# EAGLE design AVR-Pocket-Programmer (EAGLE 9.3.0)
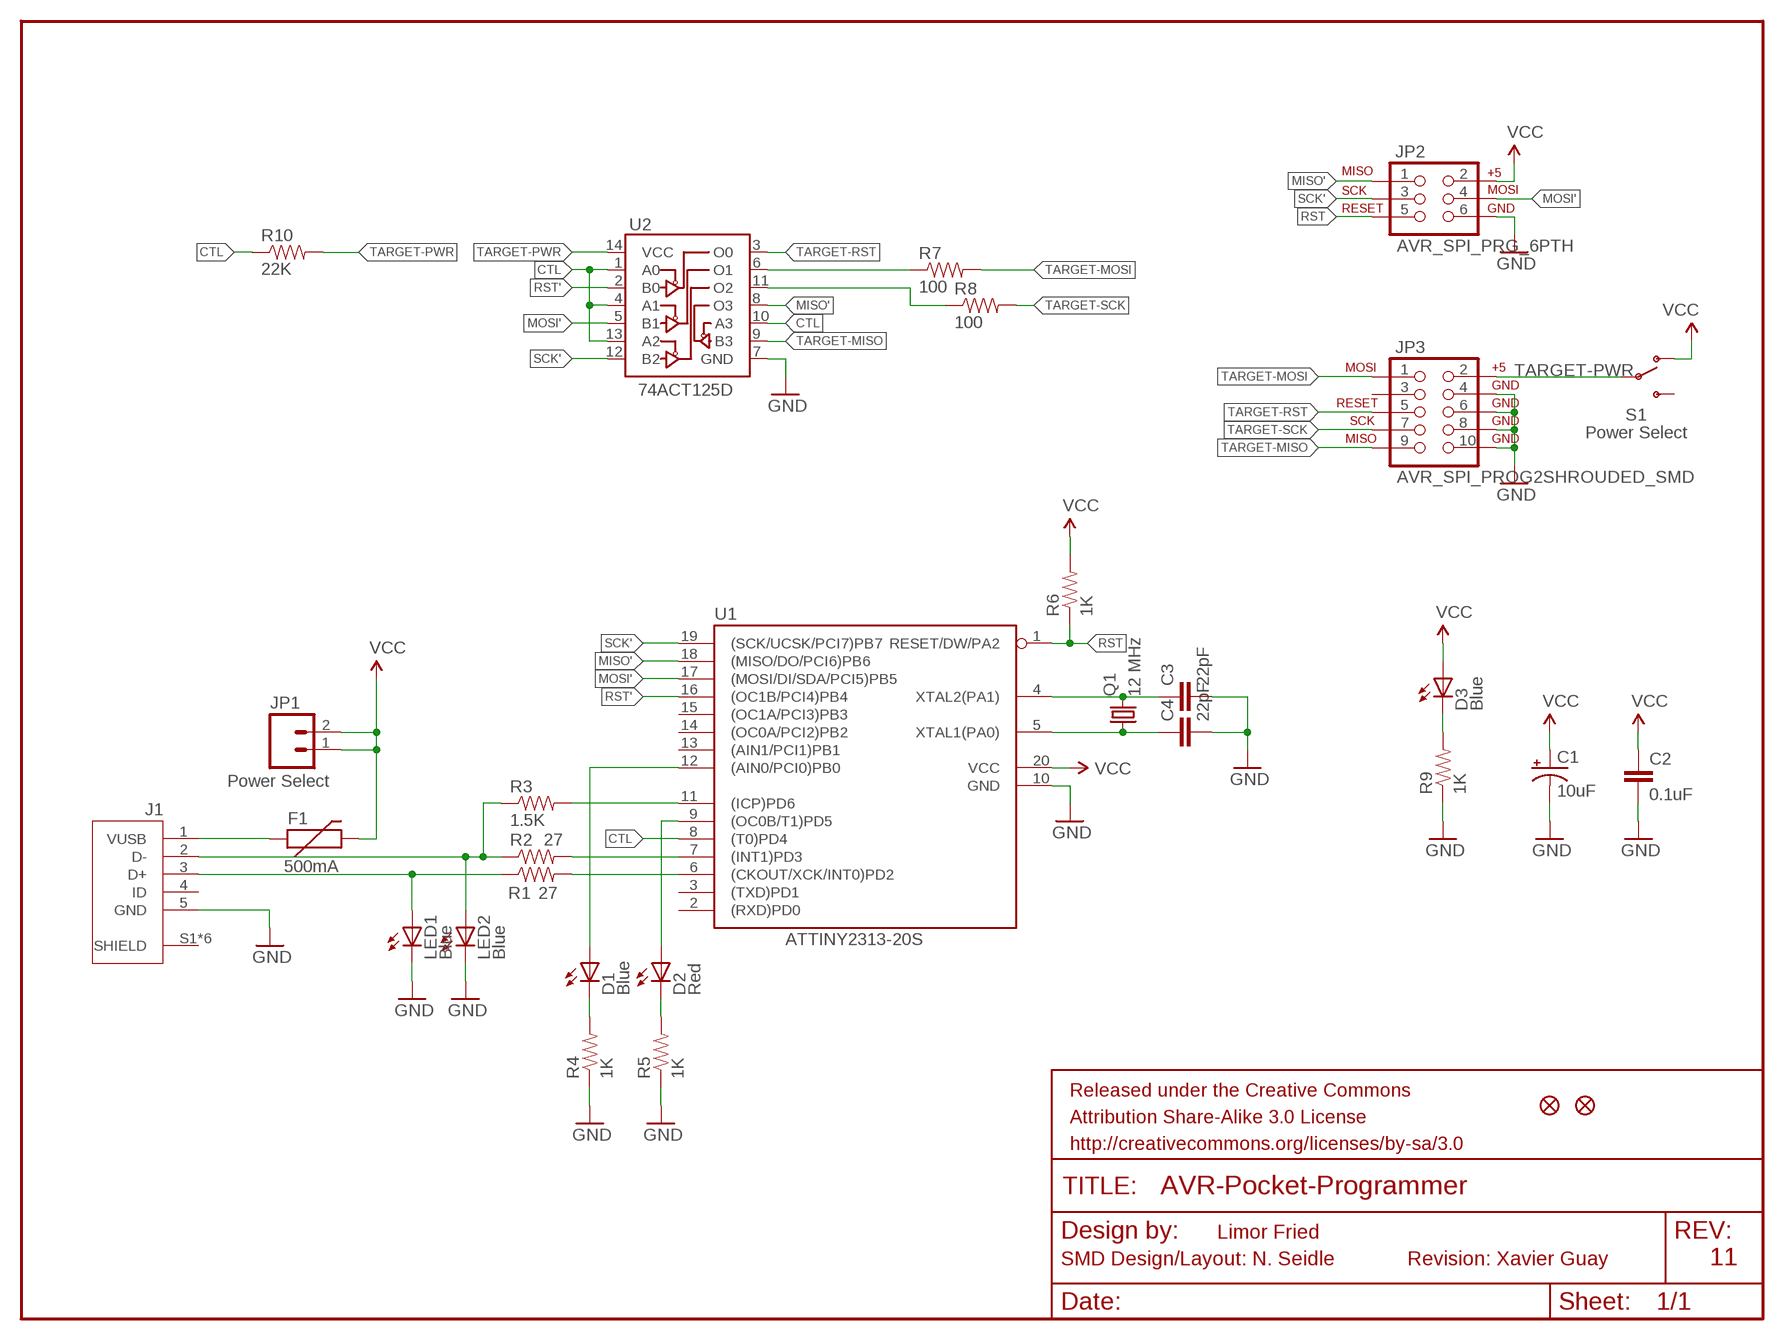
[diagram p0: schematic, sheet 1]

## Parts
C1  10uF  CAP_POL1206  [EIA3216]
C2  0.1uF  CAP0603-CAP  [0603-CAP]
C3  22pF  CAP0603-CAP  [0603-CAP]
C4  22pF  CAP0603-CAP  [0603-CAP]
D1  Blue  LED0603  [LED-0603]
D2  Red  LED0603  [LED-0603]
D3  Blue  LED0603  [LED-0603]
F1  500mA  PTCSMD-W  [PTC-1206-WIDE]
FRAME1  FRAME-LETTER  [CREATIVE_COMMONS]
J1  10118193-0001LF  [FCI_10118193-0001LF]
JP1  Power Select  M02PTH  [1X02]
JP2  AVR_SPI_PRG_6PTH  [2X3]
JP3  AVR_SPI_PROG2SHROUDED_SMD  [2X5-SHROUDED_SMD]
LED1  Blue  LED0603  [LED-0603]
LED2  Blue  LED0603  [LED-0603]
Q1  12 MHz  CRYSTAL5X3  [CRYSTAL-SMD-5X3]
R1  27  RESISTOR0603-RES  [0603-RES]
R2  27  RESISTOR0603-RES  [0603-RES]
R3  1.5K  RESISTOR0603-RES  [0603-RES]
R4  1K  RESISTOR0603-RES  [0603-RES]
R5  1K  RESISTOR0603-RES  [0603-RES]
R6  1K  RESISTOR0603-RES  [0603-RES]
R7  100  RESISTOR0603-RES  [0603-RES]
R8  100  RESISTOR0603-RES  [0603-RES]
R9  1K  RESISTOR0603-RES  [0603-RES]
R10  22K  RESISTOR0603-RES  [0603-RES]
S1  Power Select  SWITCH-SPSTSMD  [AYZ0202]
U1  ATTINY2313-20S  [SO20L]
U2  74ACT125D  [SO014]
U$6  FIDUCIAL1X2  [FIDUCIAL-1X2]
U$7  FIDUCIAL1X2  [FIDUCIAL-1X2]

## Nets
CTL: R10.1 U1.8((T0)PD4) U2.1(A0) U2.4(A1) U2.10(A3) U2.13(A2)
D+: J1.3(D+) LED1.A R1.1
D-: J1.2(D-) LED2.A R2.1 R3.1
GND: C1.C(-) C2.2 C3.2 C4.2 J1.5(GND) JP2.6 JP3.4 JP3.6 JP3.8 JP3.10 LED1.C LED2.C R4.1 R5.1 R9.1 U1.10(GND) U2.7(GND)
MISO': JP2.1 U1.18((MISO/DO/PCI6)PB6) U2.8(O3)
MOSI': JP2.4 U1.17((MOSI/DI/SDA/PCI5)PB5) U2.5(B1)
N$1: R3.2 U1.11((ICP)PD6)
N$2: D2.A U1.9((OC0B/T1)PD5)
N$3: D3.C R9.2
N$4: F1.1 J1.1(VUSB)
N$5: C3.1 Q1.3 U1.4(XTAL2(PA1))
N$6: C4.1 Q1.1 U1.5(XTAL1(PA0))
N$17: D1.A U1.12((AIN0/PCI0)PB0)
N$18: D1.C R4.2
N$19: D2.C R5.2
N$22: R7.1 U2.6(O1)
N$25: R8.1 U2.11(O2)
PD+: R1.2 U1.6((CKOUT/XCK/INT0)PD2)
PD-: R2.2 U1.7((INT1)PD3)
RST: JP2.5 R6.1 U1.1(RESET/DW/PA2)
RST': U1.16((OC1B/PCI4)PB4) U2.2(B0)
SCK': JP2.3 U1.19((SCK/UCSK/PCI7)PB7) U2.12(B2)
TARGET-MISO: JP3.9 U2.9(B3)
TARGET-MOSI: JP3.1 R7.2
TARGET-PWR: JP3.2 R10.2 S1.2(P) U2.14(VCC)
TARGET-RST: JP3.5 U2.3(O0)
TARGET-SCK: JP3.7 R8.2
VCC: C1.A(+) C2.1 D3.A F1.2 JP1.1 JP1.2 JP2.2 R6.2 S1.1(O) U1.20(VCC)
Unconnected: J1.4(ID) J1.S1(SHIELD) J1.S2(SHIELD) J1.S3(SHIELD) J1.S4(SHIELD) J1.S5(SHIELD) J1.S6(SHIELD) JP3.3 S1.3(S) U1.2((RXD)PD0) U1.3((TXD)PD1) U1.13((AIN1/PCI1)PB1) U1.14((OC0A/PCI2)PB2) U1.15((OC1A/PCI3)PB3)

## Notes on the sheet
- Limor Fried
- SMD Design/Layout: N. Seidle | Revision: Xavier Guay | 11

## Library data of the parts
C1 = SparkFun:CAP_POL: Capacitor Polarized These are standard SMD and PTH capacitors. Normally 10uF, 47uF, and 100uF in electrolytic and tantalum varieties. Always verify the external diameter of the through hole cap, it varies with capacity, voltage, and manufacturer. The EIA devices should be standard.
C2-C4 = SparkFun:CAP: Capacitor Standard 0603 ceramic capacitor, and 0.1" leaded capacitor.
D1-D3 LED1 LED2 = SparkFun:LED: LEDs Standard schematic elements and footprints for 5mm, 3mm, 1206, and 0603 sized LEDs. 5mm - Spark Fun Electronics SKU : COM-00529 (and others)
F1 = SparkFun-PowerIC:PTC: Resettable Fuse PTC Resettable Fuse. Spark Fun Electronics SKU : COM-08357
FRAME1 = SparkFun-Aesthetics:FRAME-LETTER: Schematic Frame Standard 8.5x11 US Letter frame
J1 = USB-Micro:10118193-0001LF: Micro USB B Type Receptacle; DESCRIPTION: Conn Micro USB Type B RCP 5 POS 0.65mm Solder RA SMD 5 Terminal 1 Port T/R; DIGI-KEY_PART_NUMBER: 609-4616-1-ND; DIGI-KEY_PURCHASE_URL: https://www.digikey.com/product-detail/en/amphenol-icc-fci/10118193-0001LF/609-4616-1-ND/2785380?utm_source=snapeda&utm_medium=aggregator&utm_campaign=symbol; MF: Amphenol ICC; MP: 10118193-0001LF; PACKAGE: None
JP1 = SparkFun:M02: Header 2 Standard 2-pin 0.1" header. Use with straight break away headers (SKU : PRT-00116), right angle break away headers (PRT-00553), swiss pins (PRT-00743), machine pins (PRT-00117), and female headers (PRT-00115). Molex polarized connector foot print use with SKU : PRT-08233 with associated crimp pins and housings.
JP2 = SparkFun:AVR_SPI_PRG_6: AVR ISP 6 Pin This is the reduced ISP connector for AVR programming. Common on Arduino. This footprint will take up less PCB space and can be used with a 10-pin to 6-pin adapter such as SKU: BOB-08508
JP3 = SparkFun:AVR_SPI_PROG2: AVR ICSP Header This is the standard AVR In Circuit Serial Programming header. Minimal, but includes pin one indicator. Works with standard Olimex programmers. Also look for the 6-pin reduced version. Spark Fun Electronics SKU: PRT-00778. Note that the Variant "Shrouded_SMD" is an SMD part and will not work with the thru-hole connector.
Q1 = SparkFun:CRYSTAL: Crystals Various standard crystals. Proven footprints. Spark Fun Electronics SKU : COM-00534
R1-R10 = SparkFun:RESISTOR: Resistor Basic schematic elements and footprints for 0603, 1206, and PTH 1/10th watt (small) resistors.
S1 = SparkFun:SWITCH-SPST: SPST Switch Simple slide switch. Spark Fun Electronics SKU : COM-00102
U1 = avr:ATTINY2313: MICROCONTROLLER 2 Kbytes FLASH 128 bytes SRAM 128 bytes EEPROM USART USI
U2 = SparkFun:74ACT125D: Quad Buffer with 3-State Outputs- ON Semi Conductor: Digikey P/N MC74ACT125DR2GOSTR-ND
U$6 U$7 = SparkFun:FIDUCIAL: Fiducial Alignment Points Various fiducial points for machine vision alignment.

## Net classes
0 default: width 0.203 mm, drill 0.508 mm, clearance 0.203 mm

## Board
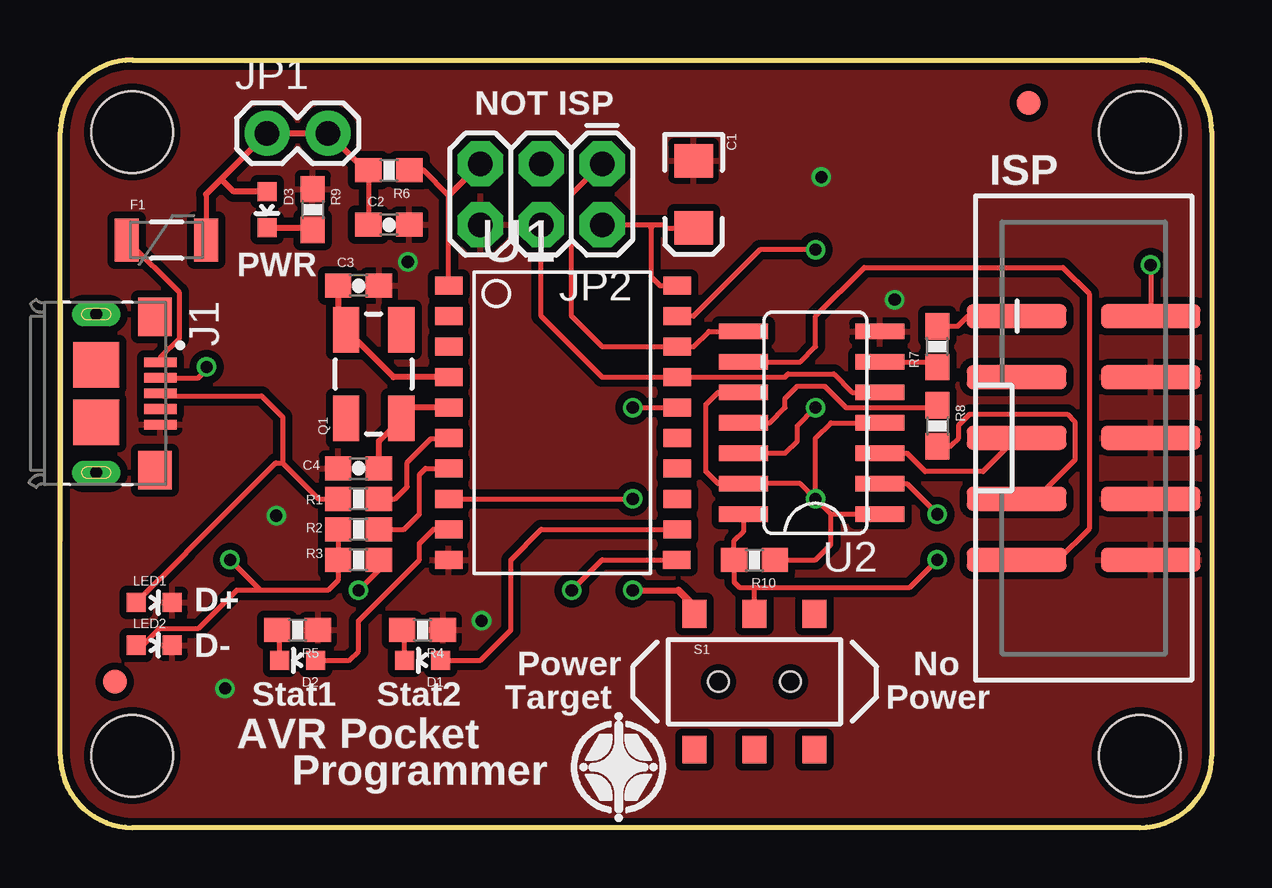
[diagram p1: board, top side]
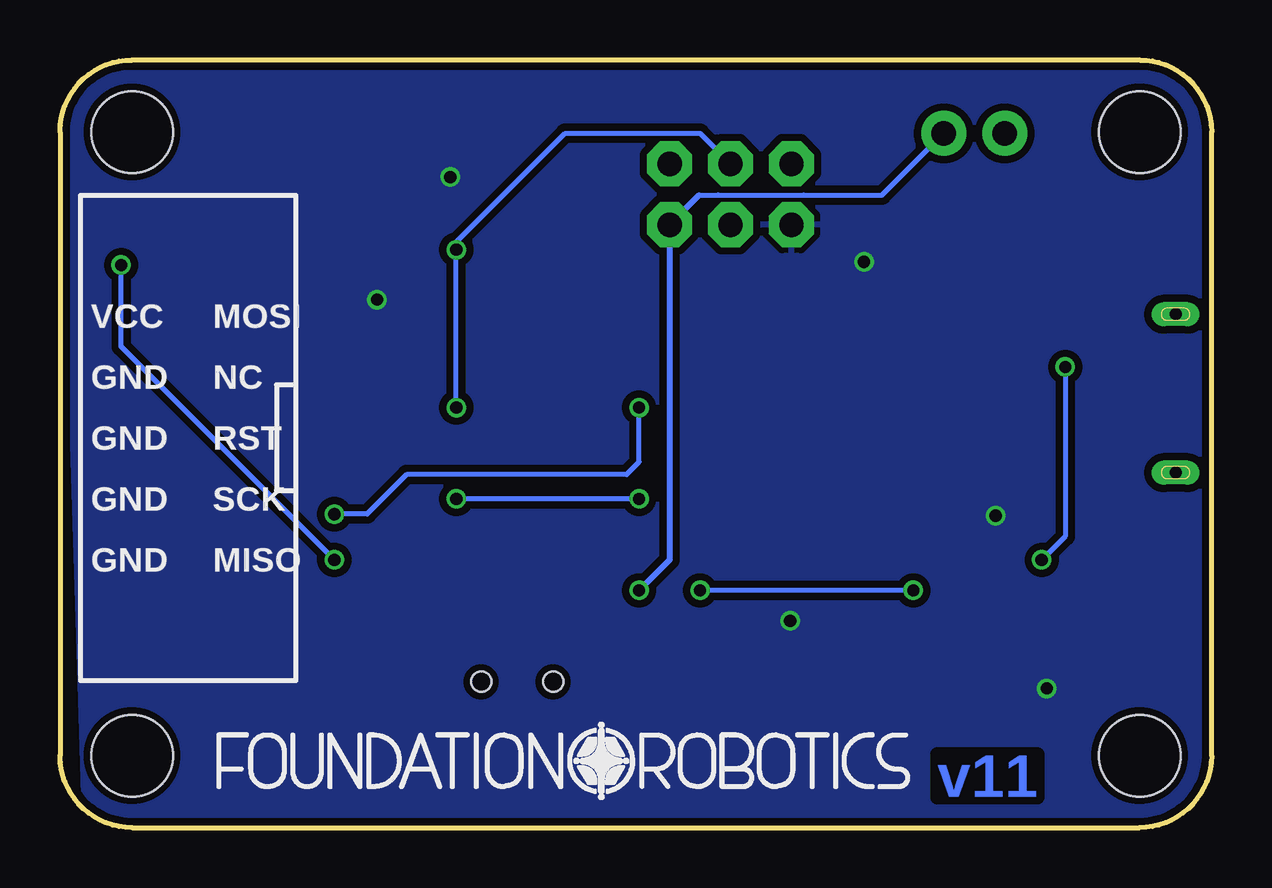
[diagram p2: board, bottom side, seen from below]

Size 48 x 32 mm. Coordinates in mm from the lower left corner, seen from the top.
Outline: 3,32 45,32 arc-90 48,29 48,3 arc-90 45,0 3,0 arc-90 0,3 0,29 arc-90 3,32
Copper layers (1*16): Top 0.035mm / dielectric 1.5mm / Bottom 0.035mm
Design rules "Seeed Fusion Design Rules": minimum track width 6mil, minimum drill 12mil, track to track 6mil, track to pad 6mil, pad to pad 6mil, via to via 6mil, smd to smd 0mil, copper to edge 10mil, drill to drill 10mil, minimum pad ring 10mil, minimum via ring 6mil, stop-mask expansion 2mil, vias tented up to drill 100mil, thermal gap 10mil
Holes 3.4 mm at 3,3 45,3 45,29 3,29

### Footprints (pad centres in the part's own frame; a part is rotated, then mirrored left to right if it is on the bottom)
EIA3216 = smd 1.4 x 1.6: A 1.4,0; C -1.4,0
0603-CAP = smd 1.1 x 1: 1 -0.85,0; 2 0.85,0
LED-0603 = smd 0.8 x 0.8: A 0,-0.75; C 0,0.75
PTC-1206-WIDE = smd 1 x 1.8: 1 -1.654,0; 2 1.654,0
FCI_10118193-0001LF = smd 0.4 x 1.35: 1 -1.3,2.675; 2 -0.65,2.675; 3 0,2.675; 4 0.65,2.675; 5 1.3,2.675 | smd 1.6 x 1.4: S1 -3.2,2.45; S2 3.2,2.45 | smd 1.9 x 1.9: S3 1.2,0; S4 -1.2,0 | drill 0.5 pad 0.9 long: S5 -3.3,0; S6 3.3,0
1X02 = drill 1.016 pad 1.88: 1 0,0; 2 2.54,0
2X3 = drill 1.016 pad 1.88 octagon: 1 0,0; 2 0,2.54; 3 2.54,0; 4 2.54,2.54; 5 5.08,0; 6 5.08,2.54
2X5-SHROUDED_SMD = smd 4.15 x 1: 1 -2.794,5.08; 2 2.794,5.08; 3 -2.794,2.54; 4 2.794,2.54; 5 -2.794,0; 6 2.794,0; 7 -2.794,-2.54; 8 2.794,-2.54; 9 -2.794,-5.08; 10 2.794,-5.08
CRYSTAL-SMD-5X3 = smd 1.9 x 1.1: 1 -1.85,-1.15; 2 1.85,-1.15; 3 1.85,1.15; 4 -1.85,1.15
0603-RES = smd 1.1 x 1: 1 -0.85,0; 2 0.85,0
AYZ0202 = smd 1 x 1.15: 1 -2.5,2.825; 2 0,2.825; 3 2.5,2.825; 4 -2.5,-2.825; 5 0,-2.825; 6 2.5,-2.825 | hole 0.85: 1.5,0; -1.5,0
SO20L = smd 0.762 x 1.143: 1 -5.08,-5.131; 2 -3.81,-5.131; 3 -2.54,-5.131; 4 -1.27,-5.131; 5 0,-5.131; 6 1.27,-5.131; 7 2.54,-5.131; 8 3.81,-5.131; 9 5.08,-5.131; 10 6.35,-5.131; 11 6.35,4.369; 12 5.08,4.394; 13 3.81,4.394; 14 2.54,4.394; 15 1.27,4.394; 16 0,4.394; 17 -1.27,4.394; 18 -2.54,4.394; 19 -3.81,4.394; 20 -5.08,4.394
SO014 = smd 0.66 x 2.032: 1 -3.175,-2.68; 2 -1.905,-2.68; 3 -0.635,-2.68; 4 0.635,-2.68; 5 1.905,-2.68; 6 3.175,-2.68; 7 4.445,-2.68; 8 4.445,2.997; 9 3.175,2.997; 10 1.905,2.997; 11 0.635,2.997; 12 -0.635,2.997; 13 -1.905,2.997; 14 -3.175,2.997
FIDUCIAL-1X2 = smd 1 x 1: 1 0,0

### Placement (x,y rotation side)
C1  26.4,26.4 270 top
C2  13.7,25.13 0 top
C3  12.43,22.59 0 top
C4  12.43,14.97 180 top
D1  15.1,6.97 90 top
D2  9.89,6.97 90 top
D3  8.62,25.77 180 top
F1  4.43,24.5 0 top
FRAME1  2.27,-10.43 0 top  (outside the outline)
J1  1.5,18.1 270 top
JP1  8.62,28.94 0 top
JP2  22.59,27.67 180 top
JP3  42.66,16.24 0 top
LED1  3.92,9.38 270 top
LED2  3.92,7.6 270 top
Q1  13.06,18.91 90 top
R1  12.43,13.7 0 top
R2  12.43,12.43 0 top
R3  12.43,11.16 0 top
R4  15.1,8.24 180 top
R5  9.89,8.24 180 top
R6  13.7,27.4 180 top
R7  36.56,20.05 90 top
R8  36.56,16.75 270 top
R9  10.53,25.77 270 top
R10  28.94,11.16 180 top
S1  28.94,6.08 0 top
U1  21.32,17.51 270 top
U2  31.48,16.24 90 top
U$6  2.27,6.08 0 top
U$7  40.37,30.21 0 top

### Tracks (layer width: path | path; a pad name or v marks a point on that pad's centre or on a via)
CTL  (via drill 0.51)
  Top 0.203: 32.12,13.06 U2.1 | v31.48,13.7 30.84,14.34 U2.13 27.42,14.34 26.91,14.84 26.91,17.64 27.42,18.14 U2.10 | v31.48,13.7 32.12,13.06 | U2.4 32.12,16.88 31.48,16.24 v31.48,13.7 | U1.8 v23.86,13.7 | R10.1 31.48,11.16 32.12,11.79 32.12,13.06
  Bottom 0.203: v23.86,13.7 v31.48,13.7
D+
  Top 0.203: 9.27,15.21 9.27,17.11 8.38,18 4.28,18 J1.3 | 9.27,15.21 10.78,13.7 R1.1 | LED1.A 5.27,11.48 5.27,11.5 8.98,15.21 9.27,15.21
D-  (via drill 0.51)
  Top 0.203: 8.35,9.89 11.16,9.89 11.58,10.31 R3.1 R2.1 | 8.35,9.89 7.35,9.89 5.77,8.31 4.14,8.31 3.44,7.6 LED2.A | v7.08,11.16 8.35,9.89 | J1.2 5.75,18.75 6.1,19.1 v6.1,19.2
  Bottom 0.203: v6.1,19.2 6.1,12.14 v7.08,11.16
GND  (via drill 0.51)
  other vias: 14.49,23.58 31.73,27.12 34.78,22.01 17.56,8.62 6.87,5.8 9,13
  pour Top (isolate 0.305): 0,0 0,32 48,32 47.99,0
  pour Bottom (isolate 0.305): 0,0 0,32 48,32 46.99,0
MISO'
  Top 0.203: JP2.1 21.32,26.4 21.32,21.32 22.59,20.05 U1.18 26.4,20.05 27.04,20.68 U2.8
MOSI'
  Top 0.203: JP2.4 20.05,21.32 22.59,18.78 U1.17 30.21,18.78 30.34,18.91 32.24,18.91 33,18.14 U2.5
N$1  (via drill 0.51)
  Top 0.203: v21.32,9.89 22.59,11.16 U1.11 | R3.2 13.28,10.74 v12.43,9.89
  Bottom 0.203: v12.43,9.89 v21.32,9.89
N$2
  Top 0.203: U1.9 15.55,12.43 14.97,11.85 14.97,11.16 12.43,8.62 12.43,7.35 12.05,6.97 D2.A
N$3
  Top 0.254: D3.C 10.43,25.02 R9.2
N$4
  Top 0.203: J1.1 4.17,19.59 4.96,20.37 4.96,22.32 F1.1
N$5
  Top 0.254: C3.1 11.58,21.09 Q1.3 13.89,18.78 U1.4
N$6
  Top 0.254: U1.5 14.67,17.51 Q1.1 13.28,16.12 C4.1
N$17
  Top 0.203: U1.12 20.05,12.43 18.78,11.16 18.78,8.24 17.51,6.97 D1.A
N$18
  Top 0.203: D1.C 14.35,8.14 R4.2
N$19
  Top 0.203: D2.C 9.14,8.14 R5.2
N$22
  Top 0.203: U2.6 36.34,19.41 R7.1
N$25
  Top 0.203: U2.11 29.57,16.88 30.21,17.51 30.21,17.89 30.72,18.4 31.86,18.4 32.75,17.51 36.47,17.51 R8.1
PD+
  Top 0.203: U1.6 16.16,16.21 15.45,16.21 14.46,15.22 14.46,14.21 13.95,13.7 R1.2
PD-
  Top 0.203: U1.7 15.22,14.97 14.97,14.72 14.97,13.06 14.34,12.43 R2.2
RST
  Top 0.203: U1.1 16.19,26.35 15.14,27.4
  Top 0.254: 16.19,26.35 JP2.5 | R6.1 15.14,27.4
RST'  (via drill 0.51)
  Top 0.203: v23.86,17.51 U1.16 | U2.2 35.29,14.34 v36.56,13.06
  Bottom 0.203: v23.86,17.51 23.86,15.24 24.38,14.72 33.54,14.72 35.2,13.06 v36.56,13.06
SCK'  (via drill 0.51)
  Top 0.203: U1.19 26.4,21.32 29.17,24.09 v31.48,24.09 | U2.12 30.21,15.61 30.72,16.11 30.72,16.75 v31.48,17.51
  Bottom 0.203: v31.48,17.51 v31.48,24.09 31.48,24.4 26.94,28.94 21.32,28.94 JP2.3
TARGET-MISO
  Top 0.203: U2.9 30.84,19.41 31.48,20.05 31.48,21.32 33.51,23.35 41.79,23.35 42.88,22.26 42.88,12.46 41.59,11.16 JP3.9
TARGET-MOSI
  Top 0.203: R7.2 37.41,20.9 37.83,21.32 JP3.1
TARGET-PWR  (via drill 0.51)
  Top 0.203: 28.94,10.02 28.3,10.02 28.09,10.23 R10.2 28.09,11.96 28.48,12.35 U2.14 | 28.94,10.02 35.42,10.02 v36.56,11.16 | v45.45,23.45 JP3.2 | S1.2 28.94,10.02
  Bottom 0.203: v36.56,11.16 45.45,20.05 v45.45,23.45
TARGET-RST
  Top 0.203: JP3.5 38.47,14.84 36.05,14.84 35.29,15.61 U2.3
TARGET-SCK
  Top 0.203: JP3.7 40.67,13.7 42.3,15.33 42.3,16.9 41.97,17.23 37.91,17.23 37.45,16.77 37.45,16.24 37.11,15.9 R8.2
VCC  (via drill 0.51)
  Top 0.203: C1.A 25.26,25 25.13,25.13 24.75,25.13 | JP2.2 24.75,25.13 | U1.20 25,22.59 24.62,22.97 24.62,25 24.75,25.13 | R6.2 C2.1 | 6.08,26.4 F1.2
  Top 0.254: v23.86,9.89 25.77,9.89 | 6.71,27.04 6.08,26.4 | 6.71,27.04 JP1.1 JP1.2 12.7,27.4 R6.2 | D3.A 7.24,26.52 6.71,27.04
  Top 0.305: S1.1 26.44,9.21 25.77,9.89
  Bottom 0.203: JP1.2 13.74,26.36 16.98,26.36 16.99,26.38 20.57,26.38 20.58,26.36 21.36,26.36
  Bottom 0.254: 21.36,26.36 JP2.2 22.59,11.16 v23.86,9.89

### Text on the board
Bottom: v11
tPlace: NOT ISP | ISP | PWR | D+ | D- | Power | No | Stat1 | Stat2 | Target | Power | AVR Pocket | Programmer
bPlace: MOSI | VCC | NC | GND | RST | GND | SCK | GND | MISO | GND
Document: Limor Fried | SMD Design/Layout: N. Seidle | Revision: Xavier Guay
tDocu: Limor Fried | SMD Design: N. Seidle | Revision: Xavier Guay